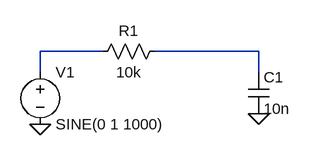
[diagram p0: schematic t_case3.asc]
t_case3.asc, the LTspice schematic file:
Version 4
SHEET 1 880 680
WIRE 112 80 16 80
WIRE 352 80 192 80
WIRE 16 112 16 80
WIRE 352 112 352 80
FLAG 16 192 0
FLAG 352 176 0
SYMBOL voltage 16 96 R0
WINDOW 123 0 0 Left 0
WINDOW 39 0 0 Left 0
SYMATTR InstName V1
SYMATTR Value SINE(0 1 1000)
SYMBOL res 208 64 R90
WINDOW 0 0 56 VBottom 2
WINDOW 3 32 56 VTop 2
SYMATTR InstName R1
SYMATTR Value 10k
SYMBOL cap 336 112 R0
SYMATTR InstName C1
SYMATTR Value 10n

The netlist it stands for:
* t_case3.asc
V1 N001 0 SINE(0 1 1000)
R1 N002 N001 10k
C1 N002 0 10n
.backanno
.end